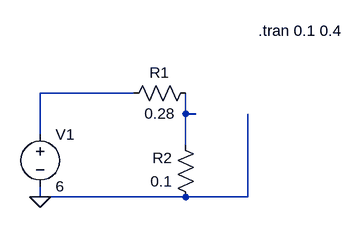
[diagram p0: schematic Draft29.asc]
Draft29.asc, the LTspice schematic file:
Version 4
SHEET 1 880 680
WIRE 320 192 176 192
WIRE 400 224 400 192
WIRE 416 224 400 224
WIRE 176 256 176 192
WIRE 400 272 400 224
WIRE 176 352 176 336
WIRE 400 352 176 352
WIRE 496 352 496 224
WIRE 496 352 400 352
FLAG 176 352 0
SYMBOL voltage 176 240 R0
SYMATTR InstName V1
SYMATTR Value 6
SYMBOL res 416 176 R90
WINDOW 0 0 56 VBottom 2
WINDOW 3 32 56 VTop 2
SYMATTR InstName R1
SYMATTR Value 0.28
SYMBOL res 416 368 R180
WINDOW 0 36 76 Left 2
WINDOW 3 36 40 Left 2
SYMATTR InstName R2
SYMATTR Value 0.1
TEXT 512 96 Left 2 !.tran 0.1 0.4

The netlist it stands for:
* Draft29.asc
V1 N001 0 6
R1 N002 N001 0.28
R2 0 N002 0.1
.tran 0.1 0.4
.backanno
.end